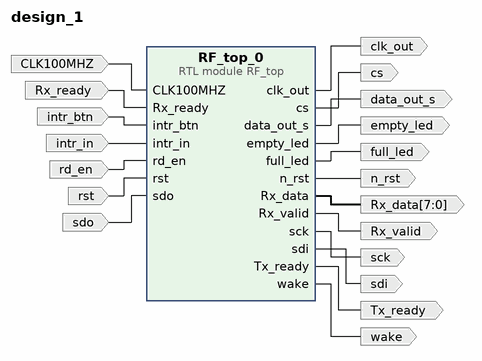
[diagram p0: block diagram of the top level]
# Vivado block design design_1, xc7s50csga324-1, Vivado 2023.2
create_bd_design design_1

create_bd_port -dir I CLK100MHZ
create_bd_port -dir I rst
create_bd_port -dir I sdo
create_bd_port -dir I intr_in
create_bd_port -dir I Rx_ready
create_bd_port -dir I rd_en
create_bd_port -dir O Tx_ready
create_bd_port -dir O -from 7 -to 0 Rx_data
create_bd_port -dir O Rx_valid
create_bd_port -dir O n_rst
create_bd_port -dir O sdi
create_bd_port -dir O sck
create_bd_port -dir O cs
create_bd_port -dir O data_out_s
create_bd_port -dir O wake
create_bd_port -dir O clk_out
create_bd_port -dir O empty_led
create_bd_port -dir O full_led
create_bd_port -dir I intr_btn

create_bd_cell -type module -reference RF_top RF_top_0

# ---- connections ----

connect_bd_net [get_bd_ports CLK100MHZ] [get_bd_pins RF_top_0/CLK100MHZ]
connect_bd_net [get_bd_pins RF_top_0/Rx_data] [get_bd_ports Rx_data]
connect_bd_net [get_bd_pins RF_top_0/Rx_valid] [get_bd_ports Rx_valid]
connect_bd_net [get_bd_pins RF_top_0/Tx_ready] [get_bd_ports Tx_ready]
connect_bd_net [get_bd_pins RF_top_0/clk_out] [get_bd_ports clk_out]
connect_bd_net [get_bd_pins RF_top_0/cs] [get_bd_ports cs]
connect_bd_net [get_bd_pins RF_top_0/data_out_s] [get_bd_ports data_out_s]
connect_bd_net [get_bd_pins RF_top_0/empty_led] [get_bd_ports empty_led]
connect_bd_net [get_bd_pins RF_top_0/full_led] [get_bd_ports full_led]
connect_bd_net [get_bd_pins RF_top_0/n_rst] [get_bd_ports n_rst]
connect_bd_net [get_bd_pins RF_top_0/sck] [get_bd_ports sck]
connect_bd_net [get_bd_pins RF_top_0/sdi] [get_bd_ports sdi]
connect_bd_net [get_bd_pins RF_top_0/wake] [get_bd_ports wake]
connect_bd_net [get_bd_ports Rx_ready] [get_bd_pins RF_top_0/Rx_ready]
connect_bd_net [get_bd_ports intr_btn] [get_bd_pins RF_top_0/intr_btn]
connect_bd_net [get_bd_ports intr_in] [get_bd_pins RF_top_0/intr_in]
connect_bd_net [get_bd_ports rd_en] [get_bd_pins RF_top_0/rd_en]
connect_bd_net [get_bd_ports rst] [get_bd_pins RF_top_0/rst]
connect_bd_net [get_bd_ports sdo] [get_bd_pins RF_top_0/sdo]

validate_bd_design
save_bd_design
